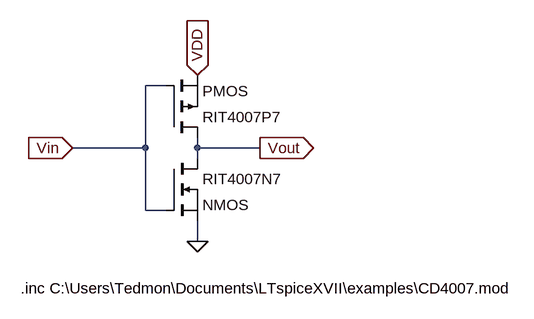
[diagram p0: schematic CMOSInverter.asc]
CMOSInverter.asc, the LTspice schematic file:
Version 4
SHEET 1 880 680
WIRE 176 -48 144 -48
WIRE 144 48 144 -48
WIRE 144 48 32 48
WIRE 224 48 224 32
WIRE 320 48 224 48
WIRE 224 64 224 48
WIRE 144 144 144 48
WIRE 176 144 144 144
WIRE 224 192 224 160
FLAG 224 192 0
FLAG 32 48 Vin
IOPIN 32 48 In
FLAG 320 48 Vout
IOPIN 320 48 Out
FLAG 224 -64 VDD
IOPIN 224 -64 In
SYMBOL nmos 176 64 R0
SYMATTR InstName RIT4007N7
SYMBOL pmos 176 32 M180
SYMATTR InstName RIT4007P7
TEXT -48 264 Left 2 !.inc C:\\Users\\Tedmon\\Documents\\LTspiceXVII\\examples\\CD4007.mod

The netlist it stands for:
* CMOSInverter.asc
M§RIT4007N7 Vout Vin 0 0 NMOS
M§RIT4007P7 Vout Vin VDD VDD PMOS
.model NMOS NMOS
.model PMOS PMOS
.lib standard.mos
.inc C:\Users\Tedmon\Documents\LTspiceXVII\examples\CD4007.mod
.backanno
.end